# Altium schematic sheet RPi-CM-Adapter.SchDoc
size A3; SheetNumber: 1; SheetTotal: 7
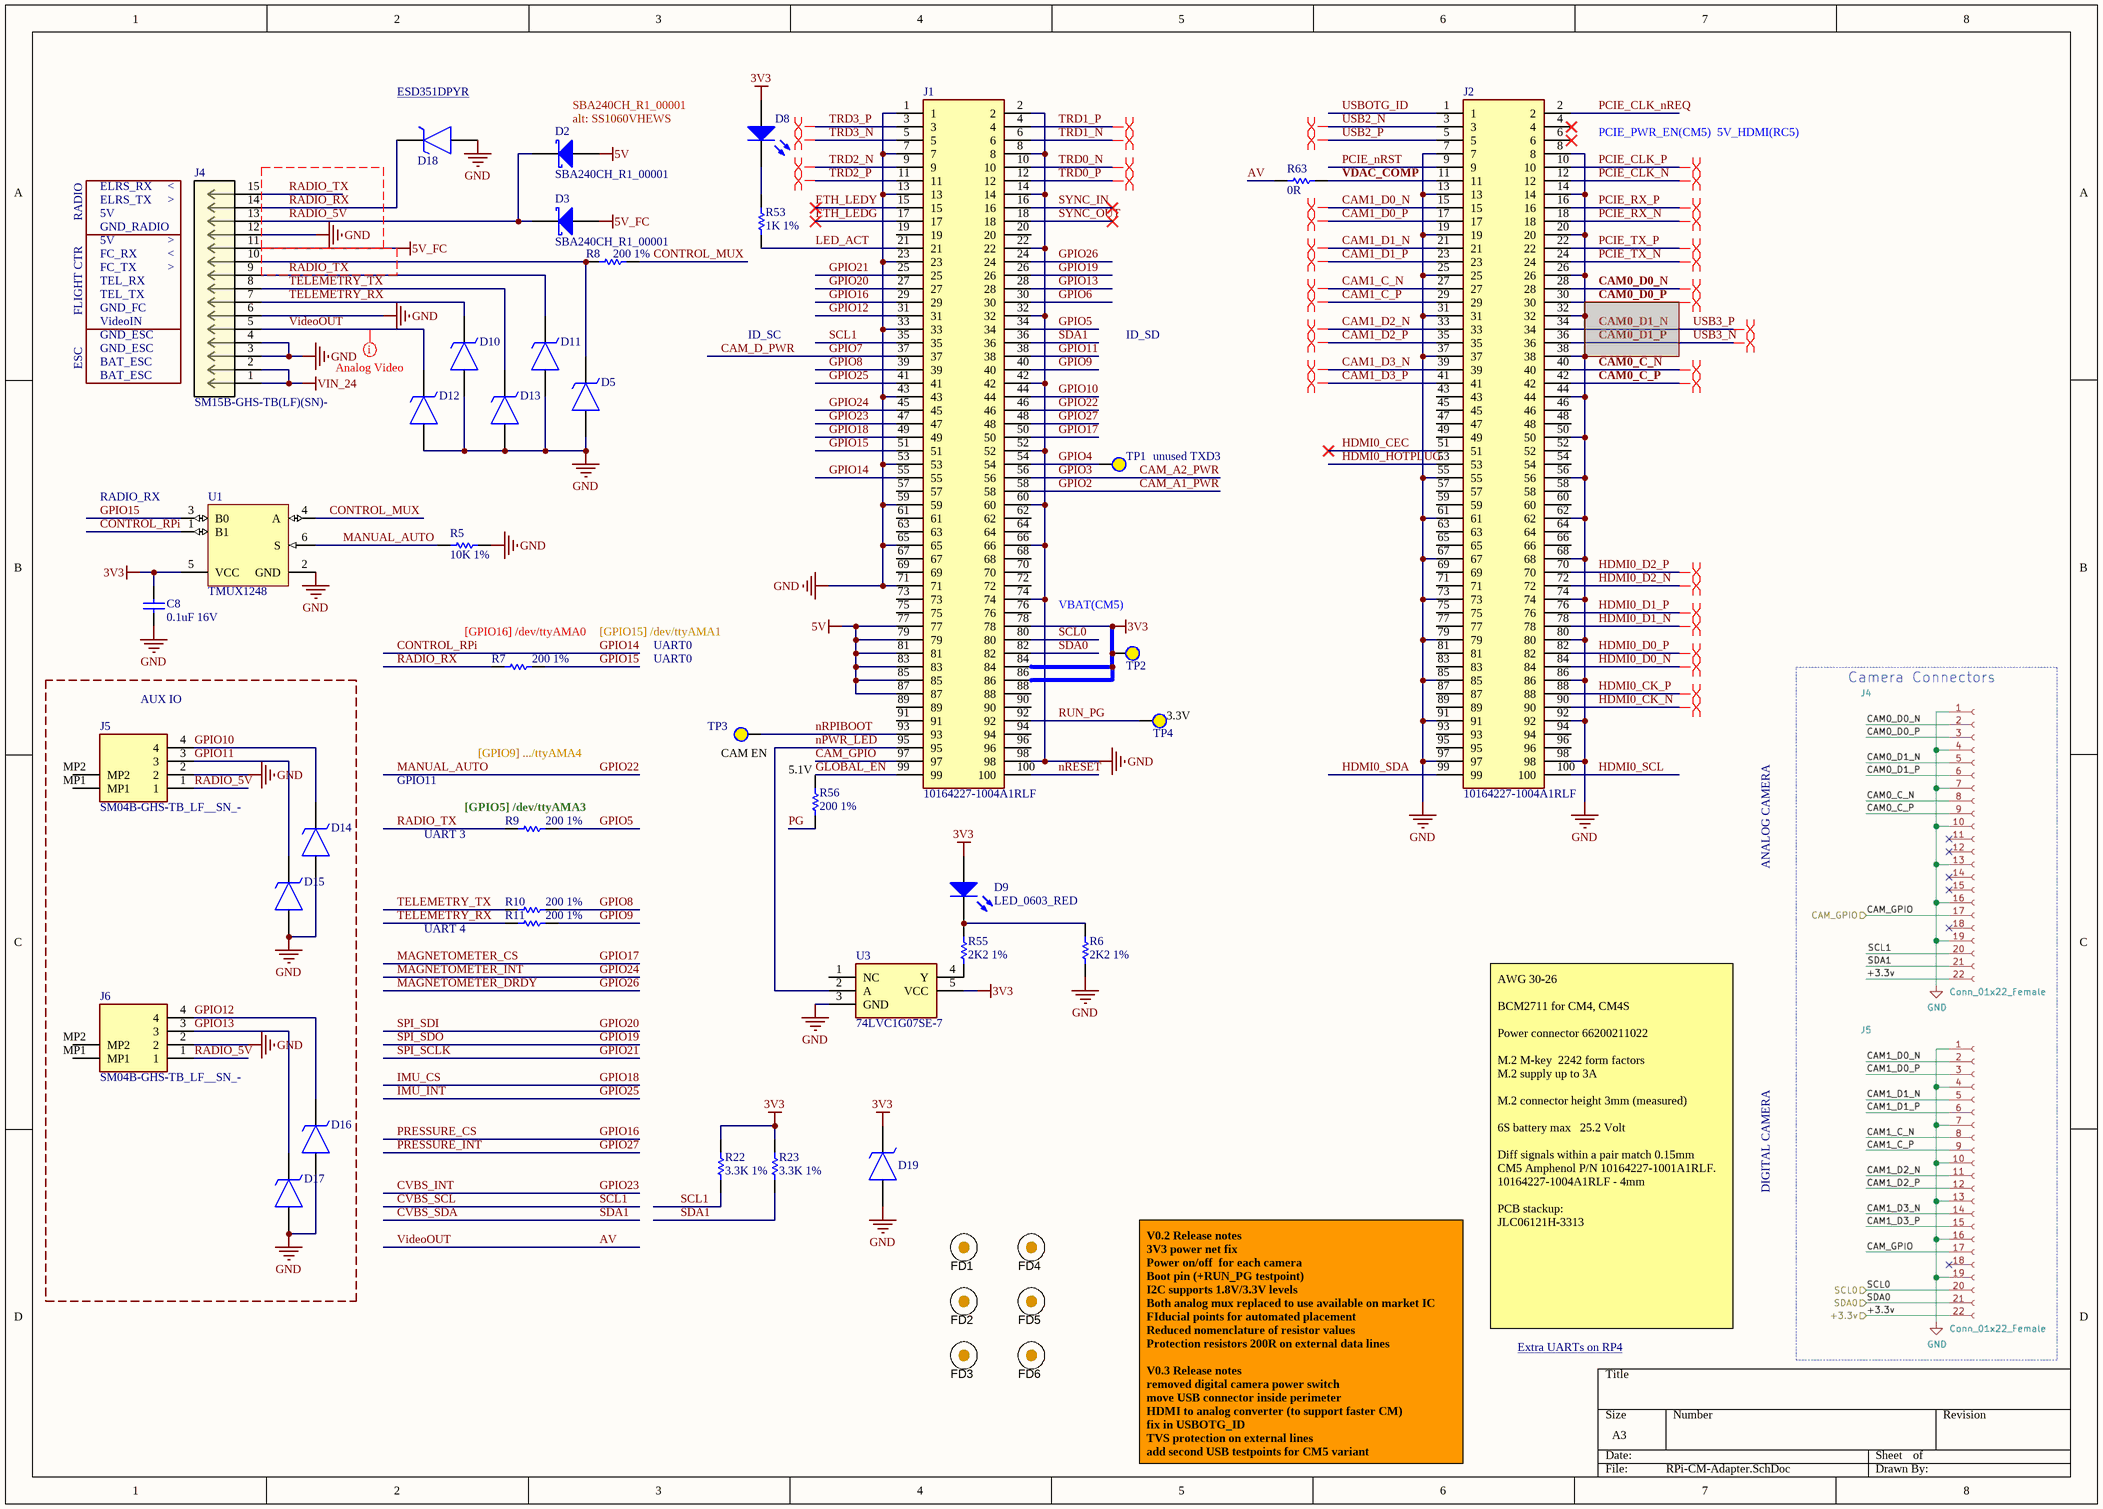
[diagram p0: RPi-CM-Adapter.SchDoc]

## Parts
C8  0.1uF 16V  [0402]
D2  SBA240CH_R1_00001  [SOD-323HE]
D3  SBA240CH_R1_00001  [SOD-323HE]
D5  ESD351DPYR  [UCLAMP2501TTCT]  (value not drawn)
D8  LED_0603_GREEN  [1608[0603]_DIODE]  (value not drawn)
D9  LED_0603_RED  [1608[0603]_DIODE]
D10  ESD351DPYR  [UCLAMP2501TTCT]  (value not drawn)
D11  ESD351DPYR  [UCLAMP2501TTCT]  (value not drawn)
D12  ESD351DPYR  [UCLAMP2501TTCT]  (value not drawn)
D13  ESD351DPYR  [UCLAMP2501TTCT]  (value not drawn)
D14  ESD351DPYR  [UCLAMP2501TTCT]  (value not drawn)
D15  ESD351DPYR  [UCLAMP2501TTCT]  (value not drawn)
D16  ESD351DPYR  [UCLAMP2501TTCT]  (value not drawn)
D17  ESD351DPYR  [UCLAMP2501TTCT]  (value not drawn)
D18  ESD351DPYR  [UCLAMP2501TTCT]  (value not drawn)
D19  ESD351DPYR  [UCLAMP2501TTCT]  (value not drawn)
FD1  Fiducial  [Fiducial10-20]  (value not drawn)
FD2  Fiducial  [Fiducial10-20]  (value not drawn)
FD3  Fiducial  [Fiducial10-20]  (value not drawn)
FD4  Fiducial  [Fiducial10-20]  (value not drawn)
FD5  Fiducial  [Fiducial10-20]  (value not drawn)
FD6  Fiducial  [Fiducial10-20]  (value not drawn)
J1  10164227-1004A1RLF  [101642271004A1RLF]
J2  10164227-1004A1RLF  [101642271004A1RLF]
J4  SM15B-GHS-TB(LF)(SN)-  [CONN_SM15B-GHS-TB]
J5  SM04B-GHS-TB_LF__SN_-  [SM04BGHSTBLFSN]
J6  SM04B-GHS-TB_LF__SN_-  [SM04BGHSTBLFSN]
R5  10K 1%  [0402]
R6  2K2 1%  [0402]
R7  200 1%  [0402]
R8  200 1%  [0402]
R9  200 1%  [0402]
R10  200 1%  [0402]
R11  200 1%  [0402]
R22  3.3K 1%  [0402]
R23  3.3K 1%  [0402]
R53  1K 1%  [0402]
R55  2K2 1%  [0402]
R56  200 1%  [0402]
R63  0R  [0402]
TP1  TESTPOINT  [TESTPOINT_0.9]  (value not drawn)  (no BOM)
TP2  TESTPOINT  [TESTPOINT_0.9]  (value not drawn)  (no BOM)
TP3  TESTPOINT  [TESTPOINT_0.9]  (value not drawn)  (no BOM)
TP4  TESTPOINT  [TESTPOINT_0.9]  (value not drawn)  (no BOM)
U1  TMUX1248  [FAIR-SC70-6_V]
U3  74LVC1G07SE-7  [SOT65P210X110-5N]

## Blocks framed on the sheet
AUX IO: D14-D17 J5 J6

## Nets
3V3: C8.1 D8.1(A) D9.1(A) D19.2(K) J1.78 J1.84 J1.86 R22.2 R23.2 TP2.1 U1.5(VCC) U3.5(VCC)
5V: D2.2(A) J1.77 J1.79 J1.81 J1.83 J1.85 J1.87
5V_FC: D3.2(A) J4.11
GND: C8.2 D5.1(A) D10.1(A) D11.1(A) D12.1(A) D13.1(A) D14.1(A) D15.1(A) D16.1(A) D17.1(A) D18.1(A) D19.1(A) J1.1 J1.2 J1.7 J1.8 J1.13 J1.14 J1.22 J1.23 J1.32 J1.33 J1.42 J1.43 J1.52 J1.53 J1.59 J1.60 J1.65 J1.66 J1.71 J1.74 J1.98 J2.7 J2.8 J2.13 J2.14 J2.19 J2.20 J2.25 J2.26 J2.31 J2.32 J2.37 J2.38 J2.44 J2.50 J2.55 J2.56 J2.61 J2.62 J2.67 J2.68 J2.73 J2.74 J2.79 J2.80 J2.85 J2.86 J2.91 J2.92 J2.97 J2.98 J4.3 J4.4 J4.6 J4.12 J5.2 J6.2 R5.1 R6.1 U1.2(GND) U3.3(GND)
VIN_24: J4.1 J4.2
AV: D12.2(K) J4.5 R63.1  [also labelled VideoOUT]
CAM0_C_N: J2.40
CAM0_C_P: J2.42
CAM0_D0_N: J2.28
CAM1_C_N: J2.27
CAM1_C_P: J2.29
CAM1_D0_N: J2.15
CAM1_D0_P: J2.17
CAM1_D1_N: J2.21
CAM1_D1_P: J2.23
CAM1_D2_N: J2.33
CAM1_D2_P: J2.35
CAM1_D3_N: J2.39
CAM1_D3_P: J2.41
CAM_A1_PWR: J1.58  [also labelled GPIO2]
CAM_A2_PWR: J1.56  [also labelled GPIO3]
CAM_D_PWR: J1.37  [also labelled GPIO7]
CAM_GPIO: J1.97
CONTROL_MUX: R8.2 U1.4(A)
CONTROL_RPi: J1.55 U1.1(B1)  [also labelled GPIO14]
CVBS_INT: J1.47  [also labelled GPIO23]
CVBS_SCL: J1.35 R22.1  [also labelled SCL1]
CVBS_SDA: J1.36 R23.1  [also labelled SDA1]
ETH_LEDG: J1.17
ETH_LEDY: J1.15
GLOBAL_EN: J1.99 R56.2
GPIO4: J1.54 TP1.1
GPIO5: J1.34 R9.2
GPIO6: J1.30
GPIO8: J1.39 R10.2
GPIO9: J1.40 R11.2
GPIO10: D14.2(K) J1.44 J5.4
GPIO11: D15.2(K) J1.38 J5.3
GPIO12: D16.2(K) J1.31 J6.4
GPIO13: D17.2(K) J1.28 J6.3
GPIO15: J1.51 R7.1 U1.3(B0)
GPIO16: J1.29  [also labelled PRESSURE_CS]
GPIO17: J1.50  [also labelled MAGNETOMETER_CS]
GPIO18: J1.49  [also labelled IMU_CS]
GPIO19: J1.26  [also labelled SPI_SDO]
GPIO20: J1.27  [also labelled SPI_SDI]
GPIO21: J1.25  [also labelled SPI_SCLK]
GPIO22: J1.46 R5.2 U1.6(S)  [also labelled MANUAL_AUTO]
GPIO24: J1.45  [also labelled MAGNETOMETER_INT]
GPIO25: J1.41  [also labelled IMU_INT]
GPIO26: J1.24  [also labelled MAGNETOMETER_DRDY]
GPIO27: J1.48  [also labelled PRESSURE_INT]
HDMI0_CEC: J2.51
HDMI0_CK_N: J2.90
HDMI0_CK_P: J2.88
HDMI0_D0_N: J2.84
HDMI0_D0_P: J2.82
HDMI0_D1_N: J2.78
HDMI0_D1_P: J2.76
HDMI0_D2_N: J2.72
HDMI0_D2_P: J2.70
HDMI0_HOTPLUG: J2.53
HDMI0_SCL: J2.100
HDMI0_SDA: J2.99
LED_ACT: J1.21 R53.1
nPWR_LED: J1.95 U3.2(A)
nRESET: J1.100
nRPIBOOT: J1.93 TP3.1
PCIE_CLK_N: J2.12
PCIE_CLK_nREQ: J2.2
PCIE_CLK_P: J2.10
PCIE_nRST: J2.9
PCIE_RX_N: J2.18
PCIE_RX_P: J2.16
PCIE_TX_N: J2.24
PCIE_TX_P: J2.22
PG: R56.1
RADIO_5V: D2.1(K) D3.1(K) J4.13 J5.1 J6.1
RADIO_RX: D18.2(K) J4.14 R7.2
RADIO_TX: D11.2(K) J4.9 J4.15 R9.1
RUN_PG: J1.92 TP4.1
SCL0: J1.80
SDA0: J1.82
SYNC_IN: J1.16
SYNC_OUT: J1.18
TELEMETRY_RX: D10.2(K) J4.7 R11.1
TELEMETRY_TX: D13.2(K) J4.8 R10.1
TRD0_N: J1.10
TRD0_P: J1.12
TRD1_N: J1.6
TRD1_P: J1.4
TRD2_N: J1.9
TRD2_P: J1.11
TRD3_N: J1.5
TRD3_P: J1.3
USB2_N: J2.3
USB2_P: J2.5
USB3_N: J2.36
USB3_P: J2.34
USBOTG_ID: J2.1
VDAC_COMP: J2.11 R63.2
NetD5_2: D5.2(K) J4.10 R8.1
NetD8_2: D8.2(K) R53.2
NetD9_2: D9.2(K) R6.2 R55.2
NetR55_1: R55.1 U3.4(Y)

Not connected (* = marked no-connect by the designer): J1 19 20 57 61 62 63 64 67 68 69 70 72 73 75 76 88 89 90 91 94 96; J2 4* 6* 30 43 45 46 47 48 49 52 54 57 58 59 60 63 64 65 66 69 71 75 77 81 83 87 89 93 94 95 96; J5 MP1 MP2; J6 MP1 MP2; U3 1(NC)

## Layout directives
differential pair; differential pair class MIPI-CAM0: CAM0_C_N, CAM0_C_P, CAM0_D0_N, NetJ2_30
differential pair; differential pair class PCIe: PCIE_CLK_N, PCIE_CLK_P, PCIE_RX_N, PCIE_RX_P, PCIE_TX_N, PCIE_TX_P
differential pair; differential pair class MIPI-CAM1: CAM1_C_N, CAM1_C_P, CAM1_D0_N, CAM1_D0_P, CAM1_D1_N, CAM1_D1_P, CAM1_D2_N, CAM1_D2_P, CAM1_D3_N, CAM1_D3_P
differential pair; differential pair class USB: USB2_N, USB2_P, USB3_N, USB3_P
net class AV: AV
differential pair; differential pair class HDMI0: HDMI0_CK_N, HDMI0_CK_P, HDMI0_D0_N, HDMI0_D0_P, HDMI0_D1_N, HDMI0_D1_P, HDMI0_D2_N, HDMI0_D2_P
differential pair; differential pair class ETH: TRD0_N, TRD0_P, TRD1_N, TRD1_P, TRD2_N, TRD2_P, TRD3_N, TRD3_P

## Notes on the sheet
- (near D18) ESD351DPYR <https://www.digikey.com/en/products/detail/texas-instruments/ESD351DPYR/9597828>
- (near D2) SBA240CH_R1_00001
- (near D2) alt: SS1060VHEWS
- PCIE_PWR_EN(CM5)  5V_HDMI(RC5)
- RADIO
- ELRS_TX
- ELRS_RX
- 5V
- GND_RADIO
- >
- <
- FLIGHT CTR
- GND_FC
- FC_TX
- FC_RX
- TEL_TX
- TEL_RX
- ESC
- VideoIN
- GND_ESC
- BAT_ESC
- ID_SC
- ID_SD
- RADIO_RX
- (near TP1) unused TXD3
- (near R7) [GPIO16] /dev/ttyAMA0
- [GPIO15] /dev/ttyAMA1
- UART0
- VBAT(CM5)
- (near TP4) 3.3V
- GPIO11
- [GPIO9] .../ttyAMA4
- (near TP3) CAM EN
- (near R56) 5.1V
- UART 3
- (near R9) [GPIO5] /dev/ttyAMA3
- ANALOG CAMERA
- UART 4
- DIGITAL CAMERA
- AWG 30-26
  BCM2711 for CM4, CM4S
  Power connector 66200211022
  M.2 M-key  2242 form factors
  M.2 supply up to 3A
  M.2 connector height 3mm (measured)
  6S battery max   25.2 Volt
  Diff signals within a pair match 0.15mm
  CM5 Amphenol P/N 10164227-1001A1RLF.
  10164227-1004A1RLF - 4mm
  PCB stackup:
  JLC06121H-3313
- Extra UARTs on RP4 <https://forums.raspberrypi.com/viewtopic.php?t=244827>
- V0.2 Release notes
  3V3 power net fix
  Power on/off  for each camera
  Boot pin (+RUN_PG testpoint)
  I2C supports 1.8V/3.3V levels
  Both analog mux replaced to use available on market IC
  FIducial points for automated placement
  Reduced nomenclature of resistor values
  Protection resistors 200R on external data lines
  V0.3 Release notes
  removed digital camera power switch
  move USB connector inside perimeter
  HDMI to analog converter (to support faster CM)
  fix in USBOTG_ID
  TVS protection on external lines
  add second USB testpoints for CM5 variant
  support RK3588 modules
  support CM5 modules
  boot adapter for initial programming
  Unified camera adapter connectivity:
  SPI
  MIPI-CSI
  I2C
  USB0
  USB1 (CM5)
  ETH
  3x GPIO
  +1.2V
  +1.8V
  +3.3V
  +5V
  use ADV GPIO
  use ADV additional analog video inputs
  >>> V4 Lite variant <<<
  -remove M2 slot
  -Single camera option
  -Ethernet connector
  -USB switch (to connect USB device) + USB  JST conector
  -Cost effective power
  replace LIS3MDL (NRND) with LIS2MDL
  series resistor on power input to filter noises
  -move camera connector to bottom

## Library data of the parts
C8 = Cap0.1UF_16V_X7R: 0402 0.1 uF 16V ±10% Tolerance X7R SMT Multilayer Ceramic Capacitor; Manufacturer: Murata; Manufacturer Part Number: GCM155R71C104KA55J; Value: 100nF; RoHS: Yes; Category: Ceramic Capacitors; Stock 1: 2121057; Pricing 1: 1=0,10000, 10=0,01800, 50=0,01800, 100=0,01500, 1000=0,00900, 10000=0,00700 (USD); Mounting Technology: Surface Mount; Case/Package: 0402; Case Code (Imperial): 0402; Case Code (Metric): 1005; Min Operating Temperature: -55°C; Max Operating Temperature: 125°C; Tolerance: 10%; Voltage Rating: 16V; Voltage Rating (DC): 16V; Packaging: Tape and Reel; Package Quantity: 1; Dielectric: X7R; Termination: SMD/SMT; Series: GCM; Construction: Flat; Length: 1mm; Width: 0.5mm; Height: 0.5mm; Thickness: 0.022inch; Depth: 0.5mm; Ratings: AEC-Q200; Radiation Hardening: No; Lead Free: Lead Free; RoHS Compliant: Yes; ComponentLink1URL: https://datasheet.ciiva.com/11618/product-11618848.pdf?src-supplier=Avnet; ComponentLink1Description: https://datasheet.ciiva.com/11618/product-11618848.pdf?src-supplier=Avnet; ComponentLink2URL: https://datasheet.ciiva.com/16440/gcm155r71c104ka55j-16440393.pdf?src-supplier=Future+Electronics; ComponentLink2Description: https://datasheet.ciiva.com/16440/gcm155r71c104ka55j-16440393.pdf?src-supplier=Future+Electronics; ComponentLink3URL: https://datasheet.ciiva.com/29542/product-29542474.pdf?src-supplier=Digi-Key; ComponentLink3Description: https://datasheet.ciiva.com/29542/product-29542474.pdf?src-supplier=Digi-Key; ComponentLink4URL: https://datasheet.ciiva.com/29542/product-29542475.pdf?src-supplier=Digi-Key; ComponentLink4Description: https://datasheet.ciiva.com/29542/product-29542475.pdf?src-supplier=Digi-Key; Supplier 1: Mouser; Supplier 2: Digi-Key; Supplier Part Number 1: 81-GCM155R71C104KA5J; Supplier Part Number 2: 490-7998-1-ND
D2 D3 = Diode SBA240CH_R1_00001: Diode Schottky 40V 2A SOD323HE; Manufacturer: Pan Jit; Supplier: Digikey; Supplier Part Number: 3757-SBA240CH_R1_00001CT-ND; Manufacturer Part Number: SBA240CH_R1_00001; RoHS: Yes; Category: Uncategorized; Stock: 27422; Pricing: 1=0.29, 10=0.18, 100=0.1122, 500=0.08274, 1000=0.0732, 2000=0.06515, 5000=0.0564, 10000=0.05099, 15000=0.04823, 25000=0.04513, 35000=0.04329, 50000=0.0415, 125000=0.03758, 250000=0.036 (USD); RoHS Compliant: Yes; Supplier 1: Digikey; Supplier Part Number 1: 3757-SBA240CH_R1_00001CT-ND
D5 D10-D19 = ESD351DPYR: 1-channel 30 k-V ESD protection diode with low clamping -Voltage in 0402 Package 2-X1SON -40 to 125; Manufacturer: Texas Instruments; Direction: 210Direction; Interface: 224Interface; Value: 1.8pF; Height: 450um; Supplier: Mouser; Supplier Part Number: 595-ESD351DPYR; Manufacturer Part Number: ESD351DPYR; RoHS: Yes; Category: ESD and Circuit Protection ICs; Stock: 138971; Pricing: 1=0.27, 10=0.183, 50=0.183, 100=0.078, 1000=0.07, 10000=0.068 (USD); Pins: 2NUMBER; ComponentLink1URL: http://www.ti.com/lit/ds/symlink/esd351.pdf?src-supplier=Digikey; ComponentLink1Description: http://www.ti.com/lit/ds/symlink/esd351.pdf?src-supplier=Digikey; Supplier 1: Mouser; Supplier Part Number 1: 595-ESD351DPYR; Length: 600um; Width: 1mm; Thickness: 370um; ComponentLink2URL: http://www.ti.com/general/docs/suppproductinfo.tsp?distId=10&amp;gotoUrl=http%3A%2F%2Fwww.ti.com%2Flit%2Fgpn%2Fesd351&src-supplier=Digikey; ComponentLink2Description: http://www.ti.com/general/docs/suppproductinfo.tsp?distId=10&amp;gotoUrl=http%3A%2F%2Fwww.ti.com%2Flit%2Fgpn%2Fesd351&src-supplier=Digikey
D8 = LED_0603_GREEN: Typical GREEN LED; Manufacturer: Rohm Semiconductor; Manufacturer Part Number: SML-310MTT86; Lens Color: Colorless; Lens Transparency: Clear; Millicandela Rating: 16mcd; Lens Style/Size: Rectangle with Flat Top, 1.20mm x 0.80mm; Voltage - Forward (Vf) (Typ): 2.2V; Current - Test: 20mA; Wavelength - Peak: 570nm; Supplier 1: DigiKey; RoHS: RoHS Compliant; Category: Optoelectronics; Stock 1: 110245; Pricing 1: 1=0.39, 10=0.277, 25=0.2124, 100=0.1386, 250=0.10164, 500=0.08624, 1000=0.07084 (USD); Packaging: Cut Tape (CT); Part Status: Not For New Designs; Color: Green; Viewing Angle: -; Mounting Type: Surface Mount; Wavelength - Dominant: -; Features: -; Package / Case: 0603 (1608 Metric); Supplier Device Package: 0603 (1608 Metric); Size / Dimension: 1.60mm L x 0.80mm W; Height (Max): 0.90mm; ComponentLink1URL: http://media.digikey.com/pdf/Data%20Sheets/Rohm%20PDFs/SML-310%20Series.pdf; ComponentLink1Description: http://media.digikey.com/pdf/Data%20Sheets/Rohm%20PDFs/SML-310%20Series.pdf; Supplier Part Number 1: 511-1299-1-ND; Supplier 2: Mouser; Supplier Part Number 2: 696-SML-LX0603GW
D9 = LED_0603_RED: Typical RED LED; Manufacturer: Lite-On Inc.; Manufacturer Part Number: LTST-C193KRKT-5A; Lens Color: Colorless; Lens Transparency: Clear; Millicandela Rating: 26.05mcd; Lens Style/Size: Rectangle with Flat Top, 1.15mm x 0.80mm; Voltage - Forward (Vf) (Typ): 2V; Current - Test: 5mA; Viewing Angle: 130°; Wavelength - Dominant: 631nm; Wavelength - Peak: 639nm; Supplier 1: Digi-Key; RoHS: RoHS Compliant; Category: Optoelectronics; Stock 1: 64943; Pricing 1: 1=0.38, 10=0.296, 100=0.1615, 250=0.10764, 500=0.0915, 1000=0.06997 (USD); Packaging: Cut Tape (CT); Color: Red; Mounting Type: Surface Mount; Features: -; Package / Case: 0603 (1608 Metric); Supplier Device Package: *; Size / Dimension: 1.60mm L x 0.80mm W; Height (Max): 0.35mm; ComponentLink1URL: http://optoelectronics.liteon.com/upload/download/DS22-2005-077/S_110_LTST-C193KRKT-5A.pdf; ComponentLink1Description: http://optoelectronics.liteon.com/upload/download/DS22-2005-077/S_110_LTST-C193KRKT-5A.pdf; Supplier Part Number 1: 160-1830-1-ND
FD1-FD6 = Fiducial: Fiducial mark.  There is nothing to buy or mount.; SymbolCreator: codlsc; SymbolVersion: 2009-11-4; CompType: Fiducial; Publisher: National Semiconductor; LatestRevisionDate: 2011-09-19; LatestRevisionNote: Added Alternate PartNumber and Alternate Manufacturer parameters to appropriate components.; ComponentLink1URL: Paste URL for datasheet here; Manufacturer: N/A; MountType: N/A; PackageReference: Fiducial; PartNumber: N/A; ClassName: FiducialMark
J1 J2 = 10164227-1004A1RLF: Connector; Manufacturer_Name: Amphenol; Datasheet Link: https://cdn.amphenol-cs.com/media/wysiwyg/files/drawing/10164227.pdf; Height: 4.1mm; Manufacturer_Part_Number: 10164227-1004A1RLF; Mouser Part Number: 649-101642271004RLF; Mouser Price/Stock: https://www.mouser.co.uk/ProductDetail/Amphenol-FCI/10164227-1004A1RLF?qs=T%252BzbugeAwjgkdT9HF7lYAw%3D%3D; Supplier 1: Mouser; Supplier Part Number 1: 649-101642271004RLF
J4 = SM15B-GHS-TB(LF)(SN)-: No Description Available; Mfr_Name: JST; RefDes: RefDes; Type: Type
J5 J6 = SM04B-GHS-TB_LF__SN_-: Conn Shrouded Header (4 Sides) HDR 4 POS 1.25mm Solder RA Side Entry SMD T/R; Manufacturer_Name: JST (JAPAN SOLDERLESS TERMINALS); Manufacturer_Part_Number: SM04B-GHS-TB(LF)(SN)-; Manufacturer: JST; Manufacturer Part Number: SM04B-GHS-TB(LF)(SN); Connector Type: 5775,5781ConnectorType; Datasheet Link: http://www.jst-mfg.com/product/pdf/eng/eGH.pdf; Height: 4.35mm; Arrow Part Number: SM04B-GHS-TB(LF)(SN)-; Arrow Price/Stock: https://www.arrow.com/en/products/sm04b-ghs-tb-lf-sn-/jst-manufacturing; Supplier: Mouser; Supplier Part Number: 306-SM04BGHSTBLFSN; RoHS: Yes; Category: Headers and Wire Housings; Stock: 2464; Pricing: 1=0.48, 10=0.39, 50=0.39, 100=0.311, 1000=0.231, 10000=0.168 (USD); Housing Material: 4261ConductorMaterial; Color: 50Colour; Housing Color: 50Colour; Packaging: 13Packaging; Fastening Type: 192,195FasteningType; Lead Free: 5697LeadFree; ComponentLink1URL: https://datasheet.ciiva.com/25617/0900766b810cef18-25617294.pdf?src-supplier=Rs; ComponentLink1Description: https://datasheet.ciiva.com/25617/0900766b810cef18-25617294.pdf?src-supplier=Rs; ComponentLink2URL: https://datasheet.ciiva.com/8052/5438-8052266.pdf?src-supplier=Element14; ComponentLink2Description: https://datasheet.ciiva.com/8052/5438-8052266.pdf?src-supplier=Element14; Supplier 1: Mouser; Supplier Part Number 1: 306-SM04BGHSTBLFSN
R5 = Res_10K_0402: Resistor; Manufacturer: Yageo; Manufacturer Part Number: RC0402FR-0710KL; Power (Watts): 0.063W, 1/16W; Temperature Coefficient: ±100ppm/°C; Supplier 1: Digi-Key; RoHS: RoHS Compliant; Category: Resistors; Stock 1: 2634839; Pricing 1: 1=0.1, 10=0.013, 25=0.0096, 100=0.0054, 250=0.00412, 500=0.00328, 1000=0.00242, 2500=0.0021, 5000=0.00173 (USD); Packaging: Cut Tape (CT); Resistance (Ohms): 10k; Tolerance: ±1%; Composition: Thick Film; Features: Moisture Resistant; Operating Temperature: -55°C ~ 155°C; Package / Case: 0402 (1005 Metric); Supplier Device Package: 0402; Size / Dimension: 0.039" L x 0.020" W (1.00mm x 0.50mm); Height: 0.016" (0.40mm); Number of Terminations: 2; ComponentLink1URL: http://www.yageo.com/NewPortal/yageodocoutput?fileName=/pdf/R-Chip/PYu-RC_Group_51_RoHS_L_3.pdf; ComponentLink1Description: http://www.yageo.com/NewPortal/yageodocoutput?fileName=/pdf/R-Chip/PYu-RC_Group_51_RoHS_L_3.pdf; Supplier Part Number 1: 311-10.0KLRCT-ND; MountType: SMT
R6 R55 = Res_2K2_0402: SMD Chip Resistor, 2.2 kOhm, ± 1%, 63 mW, 0402 [1005 Metric], Thick Film, Anti-Sulfur; Manufacturer: Yageo; Manufacturer Part Number: AF0402FR-072K2L; Value: 2.2kR; Temperature Coefficient: 100ppm/°C; Max Power Dissipation: 63mW; Voltage Rating: 50V; Supplier: Mouser; Supplier Part Number: 603-AF0402FR-072K2L; RoHS: Yes; Category: Chip SMD Resistors; Stock: 30667; Pricing: 1=0.1, 10=0.017, 50=0.017, 100=0.014, 1000=0.011, 10000=0.005 (USD); Case/Package: 0402; Min Operating Temperature: -55°C; Max Operating Temperature: 155°C; Tolerance: 1%; Packaging: Tape and Reel; Number of Terminations: 2; Series: AF; RoHS Compliant: Yes; ComponentLink1URL: http://www.yageo.com/documents/recent/PYu-AF_51_RoHS_L_5.pdf?src-supplier=Digikey; ComponentLink1Description: http://www.yageo.com/documents/recent/PYu-AF_51_RoHS_L_5.pdf?src-supplier=Digikey; Supplier 1: Mouser; Supplier Part Number 1: 603-AF0402FR-072K2L; Features: Moisture Resistant,Anti-Sulfur; Length: 0.039inch; Width: 0.02inch; Height: 0.015inch
R7-R11 R56 = Res_200R_0402: Resistor; Supplier 1: Digi-Key; Supplier Part Number 1: P200LCT-ND; MountType: SMT; Supplier 2: Mouser; Supplier Part Number 2: 667-ERJ-2RKF2000X
R22 R23 = Res_3K3_0402: SMD Chip Resistor, Thick Film, 3.3 kohm, 50 V, 0402 [1005 Metric], 1%; Manufacturer: Yageo; Manufacturer Part Number: RC0402FR-073K3L; Resistance: 3.3kR; Power Rating: 62.5mW; Voltage Rating: 50V; Max Power Dissipation: 63mW; Temperature Coefficient: 100ppm/°C; Supplier 1: Mouser; RoHS: Yes; Category: Chip SMD Resistors; Stock 1: 366531; Pricing 1: 1=0,10000, 10=0,01200, 100=0,00400, 1000=0,00300, 2500=0,00300, 10000=0,00300 (USD); Case/Package: 0402; Number of Pins: 2; Case Code (Imperial): 0402; Case Code (Metric): 1005; Min Operating Temperature: -55°C; Max Operating Temperature: 155°C; Tolerance: 1%; Voltage Rating (DC): 50V; Packaging: Tape and Reel; Package Quantity: 1; Features: Moisture Resistant; Termination: SMD/SMT; Composition: Thick Film; Number of Terminations: 2; Military Standard: Not; Length: 1mm; Height: 0.016inch; Width: 0.5mm; Depth: 0.5mm; Lead Free: Lead Free; REACH SVHC: No SVHC; ComponentLink1URL: https://datasheet.ciiva.com/11808/0900766b80c66297-11808441.pdf?src-supplier=RSComponents; ComponentLink1Description: https://datasheet.ciiva.com/11808/0900766b80c66297-11808441.pdf?src-supplier=RSComponents; ComponentLink2URL: https://datasheet.ciiva.com/2453/pyu-r-int-thick-7-2453395.pdf?src-supplier=Digi-Key; ComponentLink2Description: https://datasheet.ciiva.com/2453/pyu-r-int-thick-7-2453395.pdf?src-supplier=Digi-Key; ComponentLink3URL: https://datasheet.ciiva.com/16746/pyu-rc0402-51-rohs-l-6-r-16746361.pdf?src-supplier=Future+Electronics; ComponentLink3Description: https://datasheet.ciiva.com/16746/pyu-rc0402-51-rohs-l-6-r-16746361.pdf?src-supplier=Future+Electronics; ComponentLink4URL: https://datasheet.ciiva.com/2453/pyu-r-int-thick-7-2453394.pdf?src-supplier=Digi-Key; ComponentLink4Description: https://datasheet.ciiva.com/2453/pyu-r-int-thick-7-2453394.pdf?src-supplier=Digi-Key; ComponentLink5URL: https://datasheet.ciiva.com/2453/pyu-r-int-thick-7-2453396.pdf?src-supplier=Digi-Key; ComponentLink5Description: https://datasheet.ciiva.com/2453/pyu-r-int-thick-7-2453396.pdf?src-supplier=Digi-Key; ComponentLink6URL: https://datasheet.ciiva.com/46394/1018594-46394940.pdf?src-supplier=Element14; ComponentLink6Description: https://datasheet.ciiva.com/46394/1018594-46394940.pdf?src-supplier=Element14; Supplier Part Number 1: 603-RC0402FR-073K3L
R53 = Res_1K_0402: Resistor 1K 1% 0402; Manufacturer: Yageo; Manufacturer Part Number: RC0402FR-071KL; Power (Watts): 0.063W, 1/16W; Temperature Coefficient: ±100ppm/°C; Supplier 1: Digi-Key; RoHS: RoHS Compliant; Category: Resistors; Stock 1: 2519228; Pricing 1: 1=0.1, 10=0.013, 25=0.0096, 100=0.0054, 250=0.00412, 500=0.00328, 1000=0.00242, 2500=0.0021, 5000=0.00173 (USD); Packaging: Cut Tape (CT); Resistance (Ohms): 1k; Tolerance: ±1%; Composition: Thick Film; Features: Moisture Resistant; Operating Temperature: -55°C ~ 155°C; Package / Case: 0402 (1005 Metric); Supplier Device Package: 0402; Size / Dimension: 0.039" L x 0.020" W (1.00mm x 0.50mm); Height: 0.016" (0.40mm); Number of Terminations: 2; ComponentLink1URL: http://www.yageo.com/NewPortal/yageodocoutput?fileName=/pdf/R-Chip/PYu-RC_Group_51_RoHS_L_3.pdf; ComponentLink1Description: http://www.yageo.com/NewPortal/yageodocoutput?fileName=/pdf/R-Chip/PYu-RC_Group_51_RoHS_L_3.pdf; Supplier Part Number 1: 311-1.00KLRCT-ND; MountType: SMT
R63 = Res_0R_0402: Zero ohm Jumper 0402; Manufacturer: Yageo; Manufacturer Part Number: RC0402JR-070RL; Resistance (Ohms): 0.0; Power (Watts): 0.063W, 1/16W; Category: Resistors; Tolerance: Jumper; Supplier 1: Digi-Key; RoHS: RoHS Compliant; Stock 1: 12447313; Pricing 1: 1=0.1, 10=0.013, 25=0.0092, 100=0.0053, 250=0.004, 500=0.0032, 1000=0.00236, 2500=0.00205, 5000=0.00169 (USD); Temperature Coefficient: -; Packaging: Cut Tape (CT); Number of Terminations: 2; Features: Moisture Resistant; Height: 0.016" (0.40mm); Supplier Part Number 1: 311-0.0JRCT-ND; ComponentLink1URL: http://www.yageo.com/documents/recent/PYu-RC_Group_51_RoHS_L_2.pdf; ComponentLink1Description: http://www.yageo.com/documents/recent/PYu-RC_Group_51_RoHS_L_2.pdf; Value: 0R; Composition: Thick Film; Operating Temperature: -55°C ~ 155°C; Package / Case: 0402 (1005 Metric); Supplier Device Package: 0402; Size / Dimension: 0.039" L x 0.020" W (1.00mm x 0.50mm); MountType: SMT
U1 = TMUX1248: 3-Ω low RON, 5-V, 2: 1 (SPDT) general purpose switch with 3157 pinout 6-SC70 -40 to 125; Manufacturer: Texas Instruments; Manufacturer Part Number: TMUX1248DCKR; Category: Interface ICs; Supplier 1: Mouser; Supplier Part Number 1: 595-TMUX1248DCKR; Supplier: Mouser; Supplier Part Number: 595-TMUX1248DCKR; RoHS: No; Stock: 9814; Pricing: 1=0.55, 10=0.347, 50=0.347, 100=0.281, 1000=0.257, 10000=0.233 (USD)
U3 = 74LVC1G07SE-7: 74LVC Series 5.5 V Surface Mount Single Buffer with Open Drain Output - SOT-353; Manufacturer_Name: Diodes Incorporated; Manufacturer: Diodes; Datasheet Link: https://www.diodes.com//assets/Datasheets/74LVC1G07.pdf; Height: 1.1mm; Manufacturer_Part_Number: 74LVC1G07SE-7; Mouser Part Number: 621-74LVC1G07SE-7; Mouser Price/Stock: https://www.mouser.co.uk/ProductDetail/Diodes-Incorporated/74LVC1G07SE-7?qs=abZ1nkZpTuNoZmx9wrxFdA%3D%3D; Arrow Part Number: 74LVC1G07SE-7; Arrow Price/Stock: https://www.arrow.com/en/products/74lvc1g07se-7/diodes-incorporated?region=nac; Supplier: Mouser; Supplier Part Number: 621-74LVC1G07SE-7; Manufacturer Part Number: 74LVC1G07SE-7; RoHS: Yes; Category: Logic Gates; Stock: 84151; Pricing: 1=0.28, 10=0.191, 50=0.191, 100=0.08, 1000=0.055, 10000=0.045 (USD); ComponentLink1URL: https://datasheet.ciiva.com/26856/getdatasheetpartid-302086-26856250.pdf?src-supplier=Verical; ComponentLink1Description: https://datasheet.ciiva.com/26856/getdatasheetpartid-302086-26856250.pdf?src-supplier=Verical; ComponentLink2URL: https://datasheet.ciiva.com/8260/74lvc1g07-8260976.pdf?src-supplier=Avnet; ComponentLink2Description: https://datasheet.ciiva.com/8260/74lvc1g07-8260976.pdf?src-supplier=Avnet; ComponentLink3URL: https://datasheet.ciiva.com/1832/74lvc1g07-1832566.pdf?src-supplier=Digikey; ComponentLink3Description: https://datasheet.ciiva.com/1832/74lvc1g07-1832566.pdf?src-supplier=Digikey; ComponentLink4URL: https://datasheet.ciiva.com/1832/74lvc1g07-1832567.pdf?src-supplier=Digikey; ComponentLink4Description: https://datasheet.ciiva.com/1832/74lvc1g07-1832567.pdf?src-supplier=Digikey; ComponentLink5URL: https://datasheet.ciiva.com/1832/74lvc1g07-1832568.pdf?src-supplier=Digikey; ComponentLink5Description: https://datasheet.ciiva.com/1832/74lvc1g07-1832568.pdf?src-supplier=Digikey; ComponentLink6URL: https://datasheet.ciiva.com/8305/74lvc1g07-8305775.pdf?src-supplier=Avnet; ComponentLink6Description: https://datasheet.ciiva.com/8305/74lvc1g07-8305775.pdf?src-supplier=Avnet; ComponentLink7URL: https://datasheet.ciiva.com/1506/74lvc1g07-1506202.pdf?src-supplier=Element14; ComponentLink7Description: https://datasheet.ciiva.com/1506/74lvc1g07-1506202.pdf?src-supplier=Element14